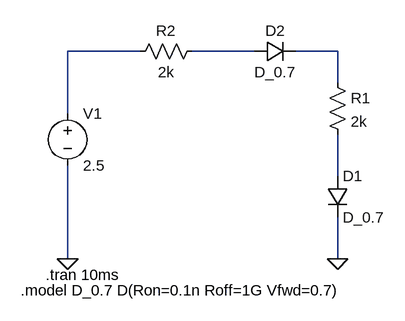
[diagram p0: schematic Q2.asc]
Q2.asc, the LTspice schematic file:
Version 4
SHEET 1 1172 680
WIRE 0 -432 -112 -432
WIRE 176 -432 80 -432
WIRE 304 -432 240 -432
WIRE 304 -384 304 -432
WIRE -112 -336 -112 -432
WIRE 304 -240 304 -304
WIRE -112 -112 -112 -256
WIRE 304 -112 304 -176
FLAG -112 -112 0
FLAG 304 -112 0
SYMBOL voltage -112 -352 R0
SYMATTR InstName V1
SYMATTR Value 2.5
SYMBOL res 288 -400 R0
SYMATTR InstName R1
SYMATTR Value 2k
SYMBOL diode 288 -240 R0
SYMATTR InstName D1
SYMATTR Value D_0.7
SYMBOL diode 176 -416 R270
WINDOW 0 32 32 VTop 2
WINDOW 3 0 32 VBottom 2
SYMATTR InstName D2
SYMATTR Value D_0.7
SYMBOL res 96 -448 R90
WINDOW 0 0 56 VBottom 2
WINDOW 3 32 56 VTop 2
SYMATTR InstName R2
SYMATTR Value 2k
TEXT -146 -88 Left 2 !.tran 10ms
TEXT -184 -64 Left 2 !.model D_0.7 D(Ron=0.1n Roff=1G Vfwd=0.7)

The netlist it stands for:
* Q2.asc
V1 N001 0 2.5
R1 N003 N004 2k
D1 N004 0 D_0.7
D2 N002 N003 D_0.7
R2 N002 N001 2k
.model D D
.lib standard.dio
.tran 10ms
.model D_0.7 D(Ron=0.1n Roff=1G Vfwd=0.7)
.backanno
.end